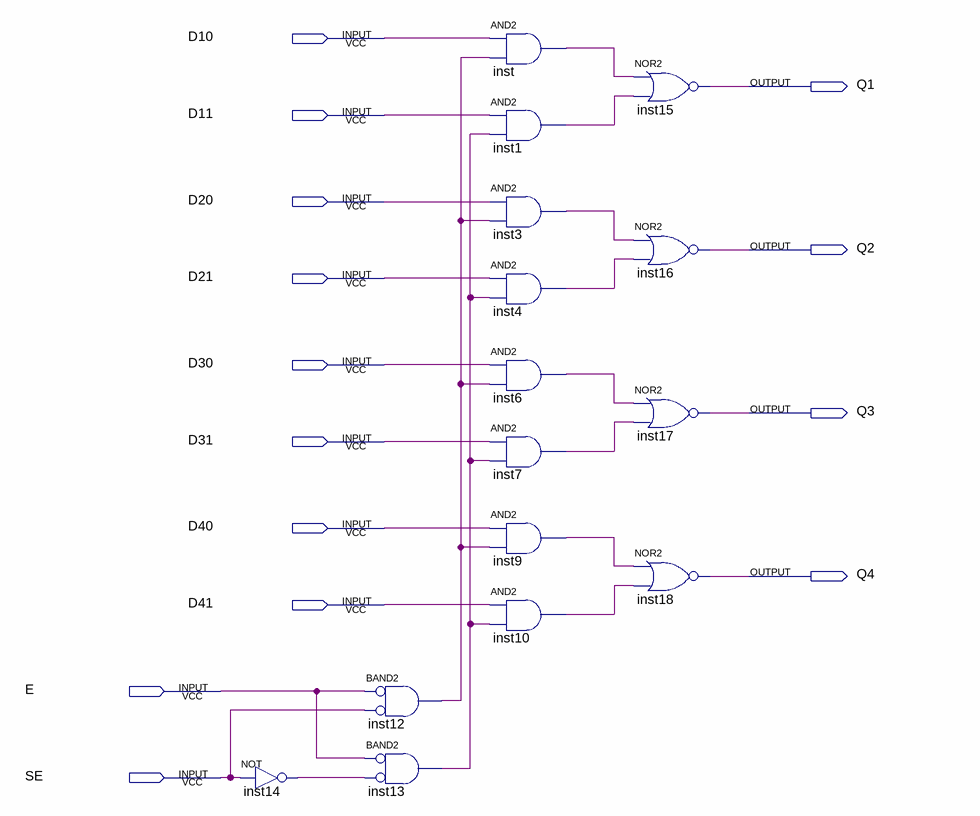
[diagram p0: schematic sheet]
// Quartus schematic kp1533KP18.bdf as structural Verilog: 15 symbols, 14 pins
module kp1533KP18 (
  input  D10,
  input  D11,
  input  D20,
  input  D21,
  input  D30,
  input  D31,
  input  D40,
  input  D41,
  input  E,
  input  SE,
  output Q1,
  output Q2,
  output Q3,
  output Q4
);

  wire inst1_out, inst3_out, inst4_out, inst6_out, inst7_out, inst9_out, inst10_out, inst12_out, inst13_out,
       inst14_out, inst_out;

  not inst14 (inst14_out, SE);
  and inst12 (inst12_out, ~E, ~SE);  // BAND2
  and inst13 (inst13_out, ~E, ~inst14_out);  // BAND2
  and inst (inst_out, D10, inst12_out);
  and inst1 (inst1_out, D11, inst13_out);
  and inst3 (inst3_out, D20, inst12_out);
  and inst4 (inst4_out, D21, inst13_out);
  and inst6 (inst6_out, D30, inst12_out);
  and inst7 (inst7_out, D31, inst13_out);
  and inst9 (inst9_out, D40, inst12_out);
  and inst10 (inst10_out, D41, inst13_out);
  nor inst15 (Q1, inst_out, inst1_out);
  nor inst16 (Q2, inst3_out, inst4_out);
  nor inst17 (Q3, inst6_out, inst7_out);
  nor inst18 (Q4, inst9_out, inst10_out);
endmodule
